# Altium schematic sheet Sheet1.SchDoc
size A4
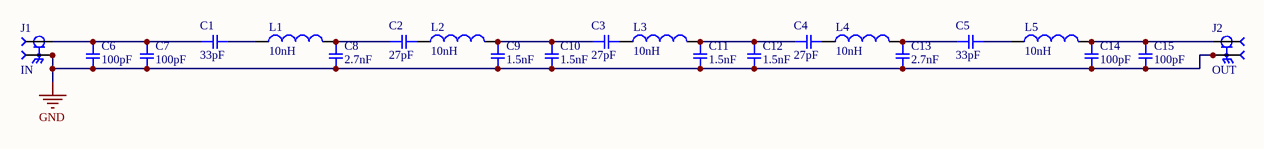
[diagram p0: Sheet1.SchDoc]

## Parts
C1  33pF  [SMD-0402C]
C2  27pF  [SMD-0402C]
C3  27pF  [SMD-0402C]
C4  27pF  [SMD-0402C]
C5  33pF  [SMD-0402C]
C6  100pF  [SMD-0402C]
C7  100pF  [SMD-0402C]
C8  2.7nF  [SMD-0402C]
C9  1.5nF  [SMD-0402C]
C10  1.5nF  [SMD-0402C]
C11  1.5nF  [SMD-0402C]
C12  1.5nF  [SMD-0402C]
C13  2.7nF  [SMD-0402C]
C14  100pF  [SMD-0402C]
C15  100pF  [SMD-0402C]
J1  IN  [LPRS_SMACONNECTOR]
J2  OUT  [LPRS_SMACONNECTOR]
L1  10nH  [0402-A]
L2  10nH  [0402-A]
L3  10nH  [0402-A]
L4  10nH  [0402-A]
L5  10nH  [0402-A]

## Nets
GND: C6.2 C7.2 C8.2 C9.2 C10.2 C11.2 C12.2 C13.2 C14.2 C15.2 J1.2 J1.3 J1.4 J1.5 J2.2 J2.3 J2.4 J2.5
NetC1_1: C1.1 C6.1 C7.1 J1.1
NetC1_2: C1.2 L1.1
NetC2_1: C2.1 C8.1 L1.2
NetC2_2: C2.2 L2.1
NetC3_1: C3.1 C9.1 C10.1 L2.2
NetC3_2: C3.2 L3.1
NetC4_1: C4.1 C11.1 C12.1 L3.2
NetC4_2: C4.2 L4.1
NetC5_1: C5.1 C13.1 L4.2
NetC5_2: C5.2 L5.1
NetC14_1: C14.1 C15.1 J2.1 L5.2

## Library data of the parts
C1 C5 = GCM1555C1H330JA16D: CAP CER 33PF 50V NP0 0402; Manufacturer: Murata Electronics North America; Factory Stock: 0; Unit Price (USD): 0.1; Minimum Quantity: 1; Tolerance: ±5%; Temperature Coefficient: C0G, NP0; Datasheets: http://www.murata.com/~/media/webrenewal/support/library/catalog/products/capacitor/mlcc/c03e.ashx; Image: //media.digikey.com/Renders/Murata%20Renders/ZRB-SERIES-0402.jpg; Digi-Key Part Number: 490-11148-1-ND; Part Number: GCM1555C1H330JA16D; Quantity Available: 57000; @ qty: 0; Packaging: Cut Tape (CT); Series: GCM; Part Status: Active; Value: 33pF; Voltage: 50V; Operating Temperature: -55°C ~ 125°C; Features: -; Ratings: AEC-Q200; Applications: Automotive; Mounting Type: Surface Mount, MLCC; Package / Case: 0402 (1005 Metric); Size / Dimension: 0.039" L x 0.020" W (1.00mm x 0.50mm); Height - Seated (Max): -; Thickness (Max): 0.022" (0.55mm); Lead Spacing: -; Lead Style: -
C2-C4 = GCM1555C1H270JA16D: CAP CER 27PF 50V NP0 0402; Manufacturer: Murata Electronics North America; Factory Stock: 0; Unit Price (USD): 0.1; Minimum Quantity: 1; Tolerance: ±5%; Temperature Coefficient: C0G, NP0; Datasheets: http://www.murata.com/~/media/webrenewal/support/library/catalog/products/capacitor/mlcc/c03e.ashx; Image: //media.digikey.com/Renders/Murata%20Renders/ZRB-SERIES-0402.jpg; Digi-Key Part Number: 490-12651-1-ND; Part Number: GCM1555C1H270JA16D; Quantity Available: 8011; @ qty: 0; Packaging: Cut Tape (CT); Series: GCM; Part Status: Active; Value: 27pF; Voltage: 50V; Operating Temperature: -55°C ~ 125°C; Features: -; Ratings: AEC-Q200; Applications: Automotive; Mounting Type: Surface Mount, MLCC; Package / Case: 0402 (1005 Metric); Size / Dimension: 0.039" L x 0.020" W (1.00mm x 0.50mm); Height - Seated (Max): -; Thickness (Max): 0.022" (0.55mm); Lead Spacing: -; Lead Style: -
C6 C7 C14 C15 = GCM1555C1H101JA16D: CAP CER 100PF 50V NP0 0402; Manufacturer: Murata Electronics North America; Factory Stock: 0; Unit Price (USD): 0.1; Minimum Quantity: 1; Tolerance: ±5%; Temperature Coefficient: C0G, NP0; Datasheets: http://www.murata.com/~/media/webrenewal/support/library/catalog/products/capacitor/mlcc/c03e.ashx; Image: //media.digikey.com/Renders/Murata%20Renders/ZRB-SERIES-0402.jpg; Digi-Key Part Number: 490-10669-1-ND; Part Number: GCM1555C1H101JA16D; Quantity Available: 61397; @ qty: 0; Packaging: Cut Tape (CT); Series: GCM; Part Status: Active; Value: 100pF; Voltage: 50V; Operating Temperature: -55°C ~ 125°C; Features: -; Ratings: AEC-Q200; Applications: Automotive; Mounting Type: Surface Mount, MLCC; Package / Case: 0402 (1005 Metric); Size / Dimension: 0.039" L x 0.020" W (1.00mm x 0.50mm); Height - Seated (Max): -; Thickness (Max): 0.022" (0.55mm); Lead Spacing: -; Lead Style: -
C8 C13 = GRM1557U1A272JA01D: CAP CER 2700PF 10V U2J 0402; Manufacturer: Murata Electronics North America; Factory Stock: 0; Unit Price (USD): 0.2; Minimum Quantity: 1; Tolerance: ±5%; Datasheets: http://www.murata.com/~/media/webrenewal/support/library/catalog/products/capacitor/mlcc/c02e.pdf; Image: //media.digikey.com/Renders/Murata%20Renders/ZRB-SERIES-0402.jpg; Digi-Key Part Number: 490-6275-1-ND; Part Number: GRM1557U1A272JA01D; Quantity Available: 21278; @ qty: 0; Packaging: Cut Tape (CT); Series: GRM; Part Status: Active; Value: 2700pF; Voltage: 10V; Temperature Coefficient: U2J; Operating Temperature: -55°C ~ 125°C; Features: -; Ratings: -; Applications: General Purpose; Mounting Type: Surface Mount, MLCC; Package / Case: 0402 (1005 Metric); Size / Dimension: 0.039" L x 0.020" W (1.00mm x 0.50mm); Height - Seated (Max): -; Thickness (Max): 0.022" (0.55mm); Lead Spacing: -; Lead Style: -
C9-C12 = GCM155R71H152KA37D: CAP CER 1500PF 50V X7R 0402; Manufacturer: Murata Electronics North America; Factory Stock: 0; Unit Price (USD): 0.1; Minimum Quantity: 1; Tolerance: ±10%; Datasheets: http://www.murata.com/~/media/webrenewal/support/library/catalog/products/capacitor/mlcc/c03e.ashx; Image: //media.digikey.com/Renders/Murata%20Renders/ZRB-SERIES-0402.jpg; Digi-Key Part Number: 490-8000-1-ND; Part Number: GCM155R71H152KA37D; Quantity Available: 79896; @ qty: 0; Packaging: Cut Tape (CT); Series: GCM; Part Status: Active; Value: 1500pF; Voltage: 50V; Temperature Coefficient: X7R; Operating Temperature: -55°C ~ 125°C; Features: -; Ratings: AEC-Q200; Applications: Automotive; Mounting Type: Surface Mount, MLCC; Package / Case: 0402 (1005 Metric); Size / Dimension: 0.039" L x 0.020" W (1.00mm x 0.50mm); Height - Seated (Max): -; Thickness (Max): 0.022" (0.55mm); Lead Spacing: -; Lead Style: -
J1 J2 = SMACONNECTOR: SMA female RF coaxial connector for SMA male RF antennas.; Package: None; Price: None; Value: *; MP: SMACONNECTOR; Availability: Unavailable
L1-L5 = Inductor: Code_IEC: 1005; Value: 10mH; Published: 8-Jun-2000; LatestRevisionDate: 29-May-2009; LatestRevisionNote: IPC-7351 Footprint Added.; PackageReference: 0402-A; Publisher: Altium Limited; PackageDescription: Chip Inductor; Code_JEITA: 0402